# EAGLE design Steering_board (EAGLE 9.3.0)
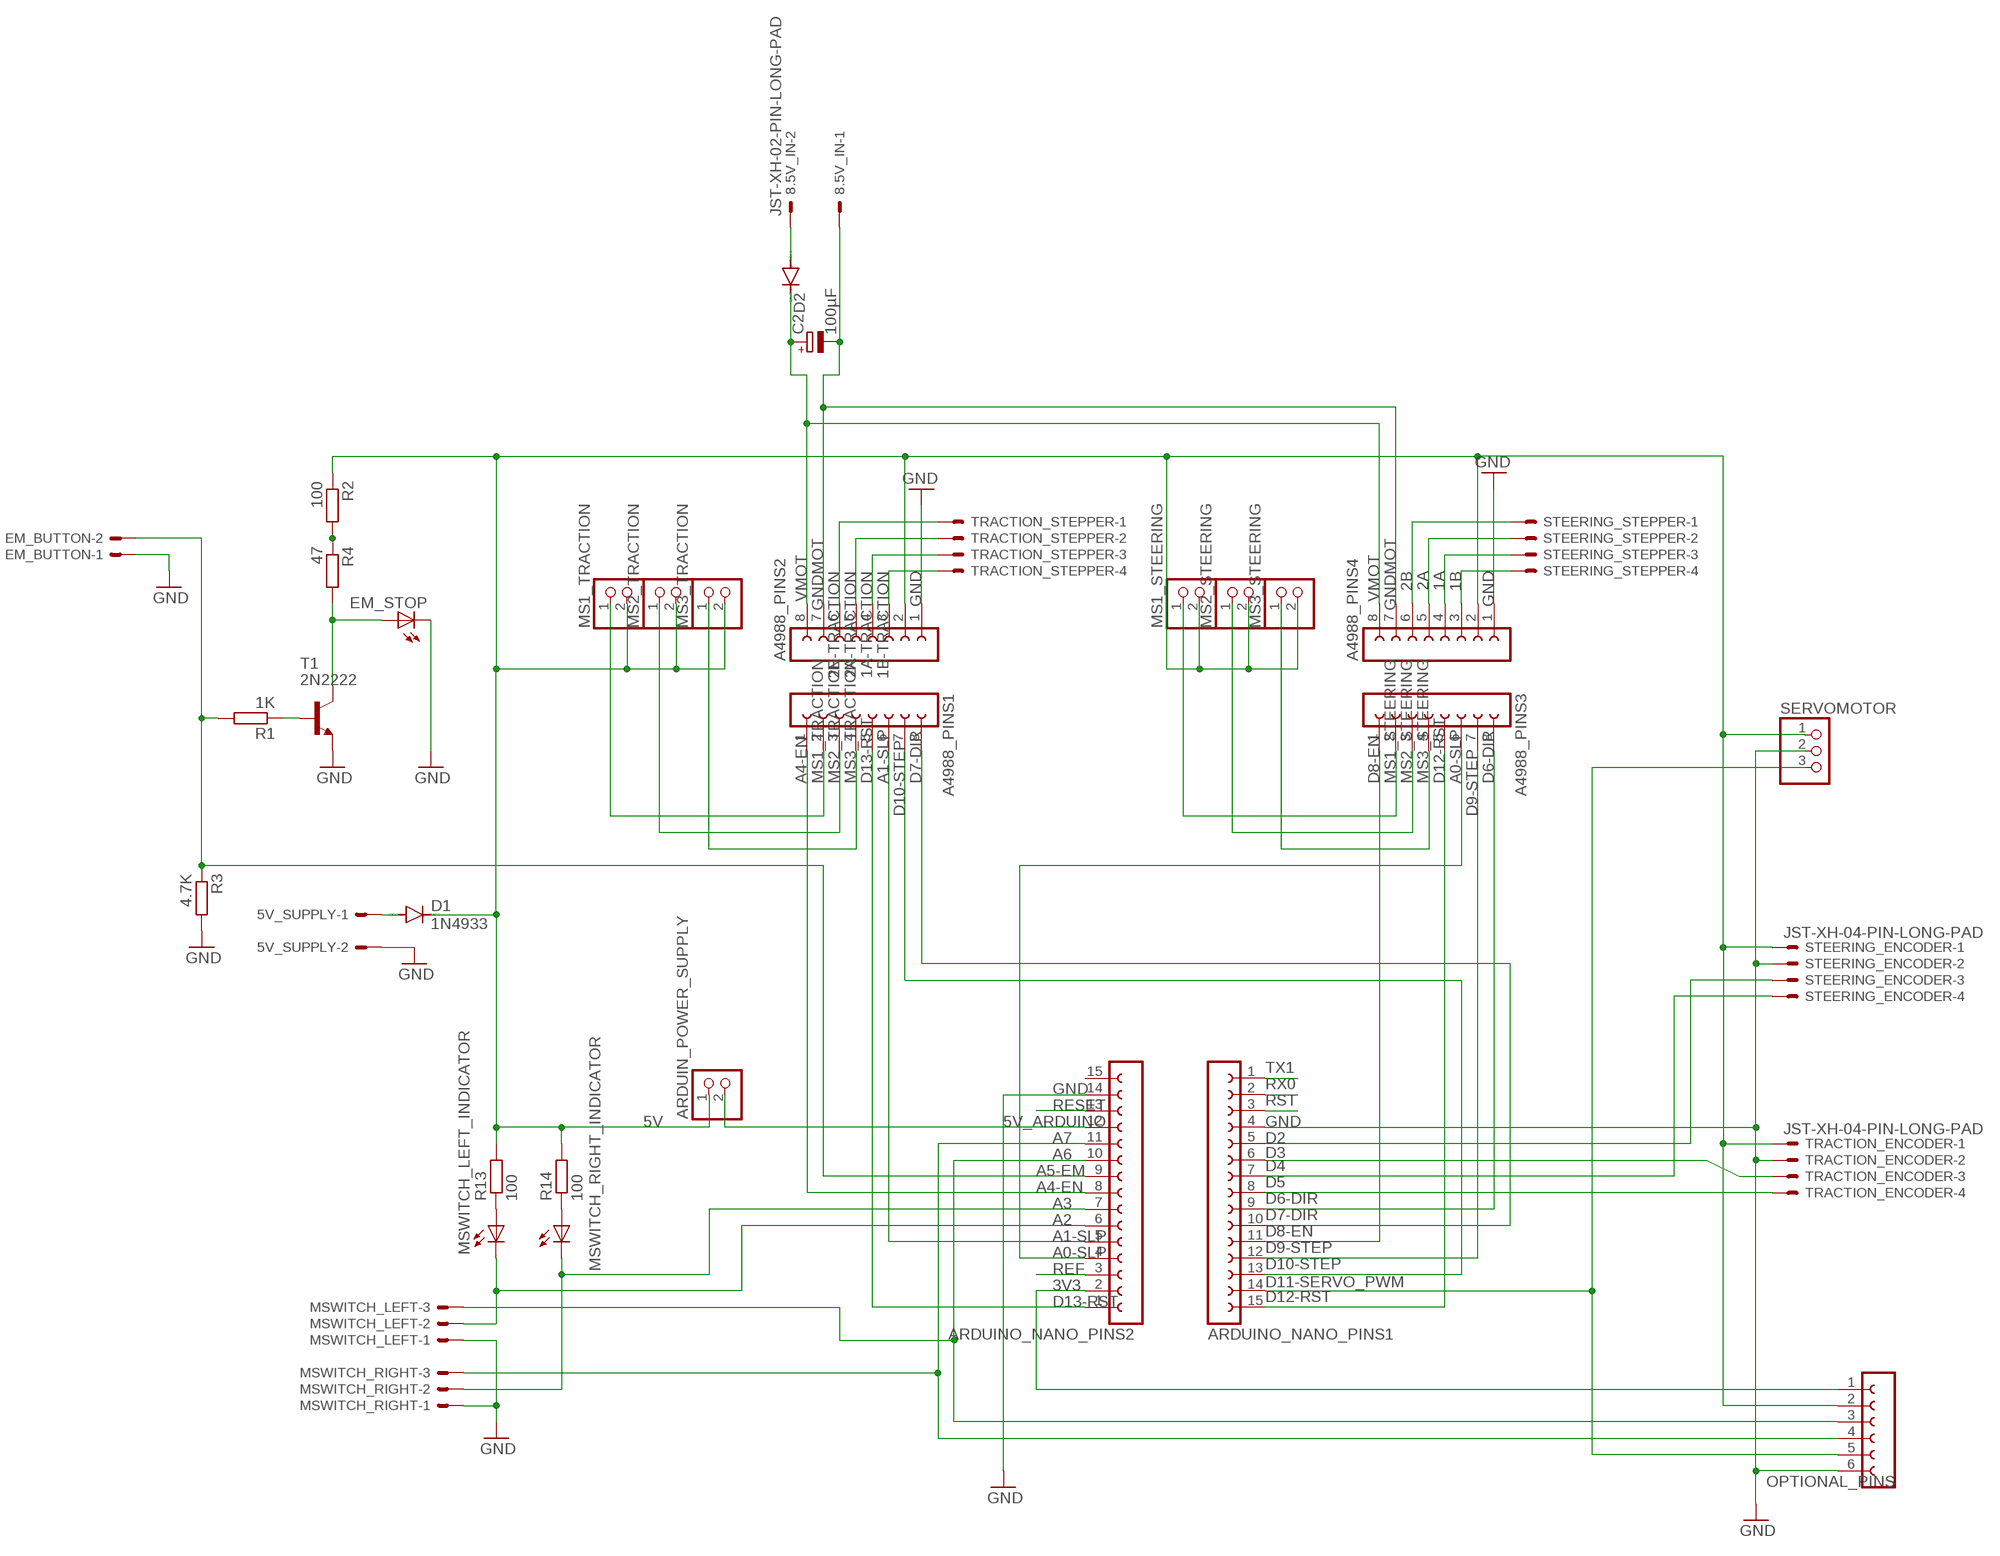
[diagram p0: schematic, sheet 1]

## Parts
5V_SUPPLY  JST-XH-02-PIN-LONG-PAD  [JST-XH-02-PACKAGE-LONG-PAD]
8.5V_IN  JST-XH-02-PIN-LONG-PAD  [JST-XH-02-PACKAGE-LONG-PAD]
A4988_PINS1  FE08-1  [FE08]
A4988_PINS2  FE08-1  [FE08]
A4988_PINS3  FE08-1  [FE08]
A4988_PINS4  FE08-1  [FE08]
ARDUIN_POWER_SUPPLY  PINHD-1X2  [1X02]
ARDUINO_NANO_PINS1  FE15-1  [FE15]
ARDUINO_NANO_PINS2  FE15-1  [FE15]
C2  100µF  CPOL-EUSANYO_E  [SANYO-OSCON_E]
D1  1N4933  [DO41-10]
D2  DIODE-DO15-12  [DO15-12]
EM_BUTTON  JST-XH-02-PIN-LONG-PAD  [JST-XH-02-PACKAGE-LONG-PAD]
EM_STOP  LED5MM  [LED5MM]
MS1_STEERING  PINHD-1X2  [1X02]
MS1_TRACTION  PINHD-1X2  [1X02]
MS2_STEERING  PINHD-1X2  [1X02]
MS2_TRACTION  PINHD-1X2  [1X02]
MS3_STEERING  PINHD-1X2  [1X02]
MS3_TRACTION  PINHD-1X2  [1X02]
MSWITCH_LEFT  JST-XH-03-PIN-LONG-PAD  [JST-XH-03-PACKAGE-LONG-PAD]
MSWITCH_LEFT_INDICATOR  LED5MM  [LED5MM]
MSWITCH_RIGHT  JST-XH-03-PIN-LONG-PAD  [JST-XH-03-PACKAGE-LONG-PAD]
MSWITCH_RIGHT_INDICATOR  LED5MM  [LED5MM]
OPTIONAL_PINS  FE06-1  [FE06]
R1  1K  R-EU_0207/7  [0207/7]
R2  100  R-EU_0207/7  [0207/7]
R3  4.7K  R-EU_0207/7  [0207/7]
R4  47  R-EU_0207/7  [0207/7]
R13  100  R-EU_0207/7  [0207/7]
R14  100  R-EU_0207/7  [0207/7]
SERVOMOTOR  PINHD-1X3  [1X03]
STEERING_ENCODER  JST-XH-04-PIN-LONG-PAD  [JST-XH-04-PACKAGE-LONG-PAD]
STEERING_STEPPER  JST-XH-04-PIN-LONG-PAD  [JST-XH-04-PACKAGE-LONG-PAD]
T1  2N2222  [TO92-EBC-OVAL]
TRACTION_ENCODER  JST-XH-04-PIN-LONG-PAD  [JST-XH-04-PACKAGE-LONG-PAD]
TRACTION_STEPPER  JST-XH-04-PIN-LONG-PAD  [JST-XH-04-PACKAGE-LONG-PAD]

## Nets
1A [Large]: A4988_PINS4.4 STEERING_STEPPER.3
1A-TRACTION [Large]: A4988_PINS2.4 TRACTION_STEPPER.3
1B [Large]: A4988_PINS4.3 STEERING_STEPPER.4
1B-TRACTION [Large]: A4988_PINS2.3 TRACTION_STEPPER.4
2A [Large]: A4988_PINS4.5 STEERING_STEPPER.2
2A-TRACTION [Large]: A4988_PINS2.5 TRACTION_STEPPER.2
2B [Large]: A4988_PINS4.6 STEERING_STEPPER.1
2B-TRACTION [Large]: A4988_PINS2.6 TRACTION_STEPPER.1
3V3: ARDUINO_NANO_PINS2.2 OPTIONAL_PINS.1
5V: A4988_PINS2.2 A4988_PINS4.2 ARDUIN_POWER_SUPPLY.1 D1.C MS1_STEERING.2 MS1_TRACTION.2 MS2_STEERING.2 MS2_TRACTION.2 MS3_STEERING.2 MS3_TRACTION.2 OPTIONAL_PINS.2 R2.1 R13.2 R14.2 SERVOMOTOR.1 STEERING_ENCODER.1 TRACTION_ENCODER.1
5V_ARDUINO: ARDUIN_POWER_SUPPLY.2 ARDUINO_NANO_PINS2.12
A0-SLP: A4988_PINS3.6 ARDUINO_NANO_PINS2.4
A1-SLP: A4988_PINS1.6 ARDUINO_NANO_PINS2.5
A2: ARDUINO_NANO_PINS2.6 MSWITCH_LEFT.2 MSWITCH_LEFT_INDICATOR.K(C)
A3: ARDUINO_NANO_PINS2.7 MSWITCH_RIGHT.2 MSWITCH_RIGHT_INDICATOR.K(C)
A4-EN: A4988_PINS1.1 ARDUINO_NANO_PINS2.8
A5-EM: ARDUINO_NANO_PINS2.9 EM_BUTTON.2 R1.2 R3.1
A6: ARDUINO_NANO_PINS2.10 MSWITCH_LEFT.3 OPTIONAL_PINS.3
A7: ARDUINO_NANO_PINS2.11 MSWITCH_RIGHT.3 OPTIONAL_PINS.4
D2: ARDUINO_NANO_PINS1.5 STEERING_ENCODER.3
D3: ARDUINO_NANO_PINS1.6 TRACTION_ENCODER.3
D4: ARDUINO_NANO_PINS1.7 STEERING_ENCODER.4
D5: ARDUINO_NANO_PINS1.8 TRACTION_ENCODER.4
D6-DIR: A4988_PINS3.8 ARDUINO_NANO_PINS1.9
D7-DIR: A4988_PINS1.8 ARDUINO_NANO_PINS1.10
D8-EN: A4988_PINS3.1 ARDUINO_NANO_PINS1.11
D9-STEP: A4988_PINS3.7 ARDUINO_NANO_PINS1.12
D10-STEP: A4988_PINS1.7 ARDUINO_NANO_PINS1.13
D11-SERVO_PWM: ARDUINO_NANO_PINS1.14 OPTIONAL_PINS.5 SERVOMOTOR.3
D12-RST: A4988_PINS3.5 ARDUINO_NANO_PINS1.15
D13-RST: A4988_PINS1.5 ARDUINO_NANO_PINS2.1
GND: 5V_SUPPLY.2 A4988_PINS2.1 A4988_PINS4.1 ARDUINO_NANO_PINS1.4 ARDUINO_NANO_PINS2.14 EM_BUTTON.1 EM_STOP.K(C) MSWITCH_LEFT.1 MSWITCH_RIGHT.1 OPTIONAL_PINS.6 R3.2 SERVOMOTOR.2 STEERING_ENCODER.2 T1.E TRACTION_ENCODER.2
GNDMOT [Large]: 8.5V_IN.1 A4988_PINS2.7 A4988_PINS4.7 C2.-
MS1_STEERING: A4988_PINS3.2 MS1_STEERING.1
MS1_TRACTION: A4988_PINS1.2 MS1_TRACTION.1
MS2_STEERING: A4988_PINS3.3 MS2_STEERING.1
MS2_TRACTION: A4988_PINS1.3 MS2_TRACTION.1
MS3_STEERING: A4988_PINS3.4 MS3_STEERING.1
MS3_TRACTION: A4988_PINS1.4 MS3_TRACTION.1
N$1 [Large]: 8.5V_IN.2 D2.A
N$2: 5V_SUPPLY.1 D1.A
N$4: R2.2 R4.1
N$6: EM_STOP.A R4.2 T1.C
N$7: R1.1 T1.B
N$29: MSWITCH_LEFT_INDICATOR.A R13.1
N$30: MSWITCH_RIGHT_INDICATOR.A R14.1
REF: ARDUINO_NANO_PINS2.3
RESET: ARDUINO_NANO_PINS2.13
RST: ARDUINO_NANO_PINS1.3
RX0: ARDUINO_NANO_PINS1.2
TX1: ARDUINO_NANO_PINS1.1
VMOT [Large]: A4988_PINS2.8 A4988_PINS4.8 C2.+ D2.C
Unconnected: ARDUINO_NANO_PINS2.15

## Library data of the parts
5V_SUPPLY 8.5V_IN EM_BUTTON = Rembrandt Electronics - JST XH Connectors v1-0:JST-XH-02-PIN: JST XH Connector 2 Pin Wire to board connector. Pitch: 2,54 mm, (0.100") Number of pins: 2 Created by Rembrandt Electronics www.rembrandtelectronics.com
A4988_PINS1-A4988_PINS4 = con-lsta:FE08-1: FEMALE HEADER; OC_FARNELL: unknown; OC_NEWARK: unknown
ARDUIN_POWER_SUPPLY MS1_STEERING MS1_TRACTION MS2_STEERING MS2_TRACTION MS3_STEERING MS3_TRACTION = pinhead:PINHD-1X2: PIN HEADER
ARDUINO_NANO_PINS1 ARDUINO_NANO_PINS2 = con-lsta:FE15-1: FEMALE HEADER; OC_FARNELL: unknown; OC_NEWARK: unknown
C2 = rcl:CPOL-EU: POLARIZED CAPACITOR, European symbol; SPICEPREFIX: C
D1 = diode:1N4933: DIODE fast recovery rectifier, 1A
D2 = diode:DIODE-: DIODE
EM_STOP MSWITCH_LEFT_INDICATOR MSWITCH_RIGHT_INDICATOR = adafruit:LED: LED OSRAM: - CHIPLED LG R971, LG N971, LY N971, LG Q971, LY Q971, LO R971, LY R971 LH N974, LH R974 LS Q976, LO Q976, LY Q976 LO Q996 - Hyper CHIPLED LW Q18S LB Q993, LB Q99A, LB R99A - SideLED LS A670, LO A670, LY A670, LG A670, LP A670 LB A673, LV A673, LT A673, LW A673 LH A674 LY A675 LS A676, LA A676, LO A676, LY A676, LW A676 LS A679, LY A679, LG A679 - Hyper Micro SIDELED® LS Y876, LA Y876, LO Y876, LY Y876 LT Y87S - SmartLED LW L88C, LW L88S LB L89C, LB L89S, LG L890 LS L89K, LO L89K, LY L89K LS L896, LA L896, LO L896, LY L896 - TOPLED LS T670, LO T670, LY T670, LG T670, LP T670 LSG T670, LSP T670, LSY T670, LOP T670, LYG T670 LG T671, LOG T671, LSG T671 LB T673, LV T673, LT T673, LW T673 LH T674 LS T676, LA T676, LO T676, LY T676, LB T676, LH T676, LSB T676, LW T676 LB T67C, LV T67C, LT T67C, LS T67K, LO T67K, LY T67K, LW E67C LS E67B, LA E67B, LO E67B, LY E67B, LB E67C, LV E67C, LT E67C LW T67C LS T679, LY T679, LG T679 LS T770, LO T770, LY T770, LG T770, LP T770 LB T773, LV T773, LT T773, LW T773 LH T774 LS E675, LA E675, LY E675, LS T675 LS T776, LA T776, LO T776, LY T776, LB T776 LHGB T686 LT T68C, LB T68C - Hyper Mini TOPLED® LB M676 - Mini TOPLED Santana® LG M470 LS M47K, LO M47K, LY M47K Source: http://www.osram.convergy.de/
MSWITCH_LEFT MSWITCH_RIGHT = Rembrandt Electronics - JST XH Connectors v1-0:JST-XH-03-PIN: JST XH Connector 2 Pin Wire to board connector. Pitch: 2,54 mm, (0.100") Number of pins: 3 Created by Rembrandt Electronics www.rembrandtelectronics.com
OPTIONAL_PINS = con-lsta:FE06-1: FEMALE HEADER; OC_FARNELL: unknown; OC_NEWARK: unknown
R1-R4 R13 R14 = rcl:R-EU_: RESISTOR, European symbol; SPICEPREFIX: R
SERVOMOTOR = adafruit:PINHD-1X3: PIN HEADER
STEERING_ENCODER STEERING_STEPPER TRACTION_ENCODER TRACTION_STEPPER = Rembrandt Electronics - JST XH Connectors v1-0:JST-XH-04-PIN: JST XH Connector 2 Pin Wire to board connector. Pitch: 2,54 mm, (0.100") Number of pins: 4 Created by Rembrandt Electronics www.rembrandtelectronics.com
T1 = adafruit:2N2222: NPN TRANSISTOR Big oval pads

## Net classes
1 Large: width 1 mm, drill 0.65 mm

## Board
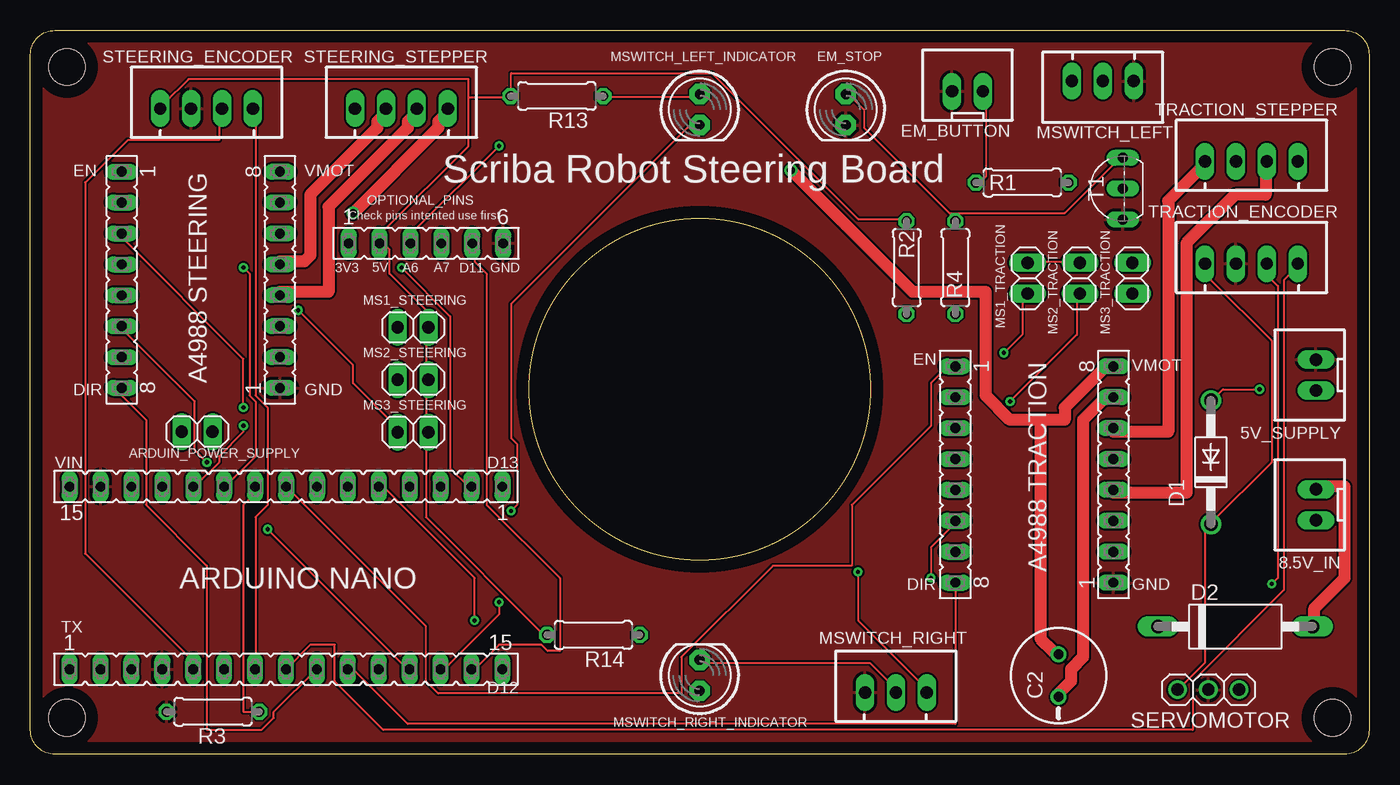
[diagram p1: board, top side]
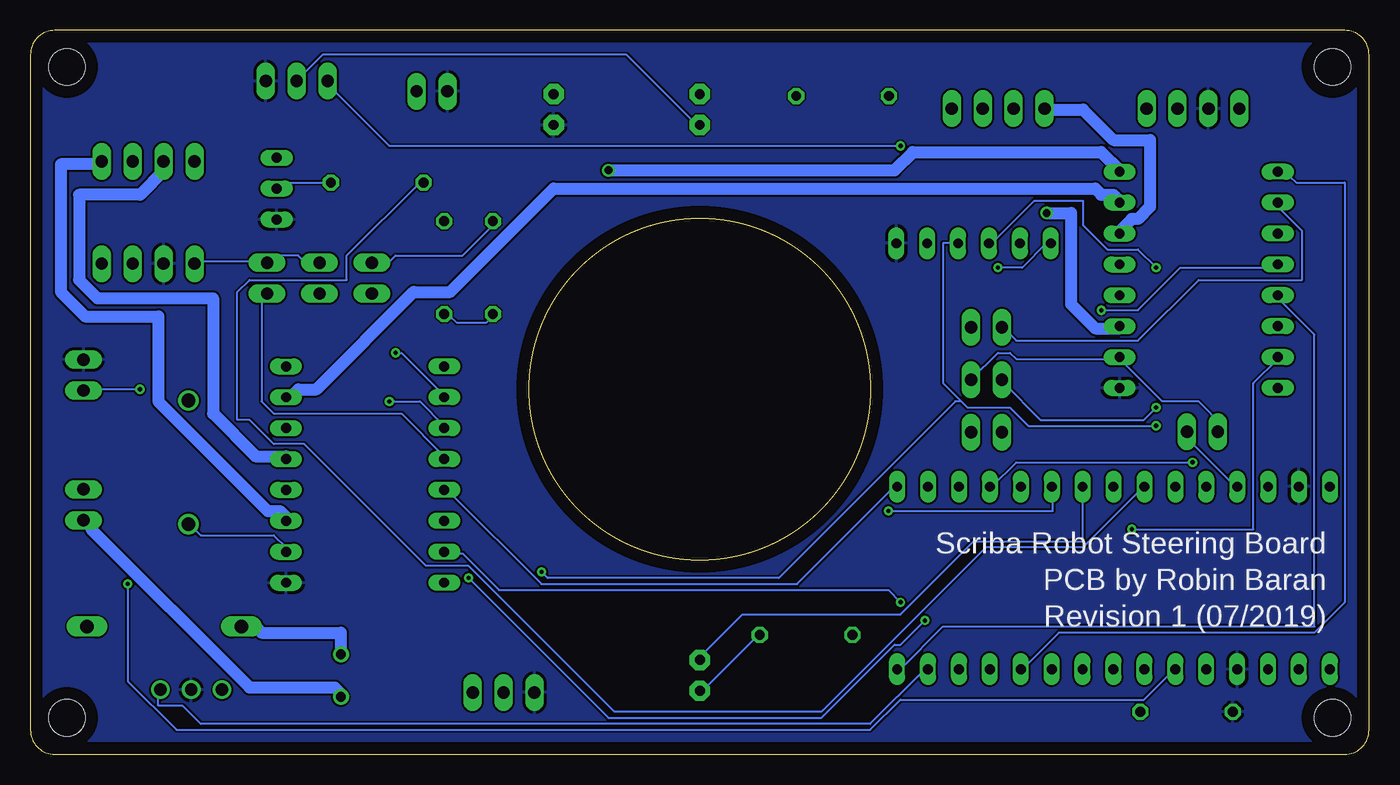
[diagram p2: board, bottom side, seen from below]

Size 110 x 59.5 mm. Coordinates in mm from the lower left corner, seen from the top.
Outline: 2,59.5 108,59.5 arc-90 110,57.5 110,2 arc-90 108,0 2,0 arc-90 0,2 0,57.5 arc-90 2,59.5
Outline: circle at 55,30 radius 14.04
Copper layers (1*16): Top 0.035mm / dielectric 1.5mm / Bottom 0.035mm
Design rules "default": minimum track width 6mil, minimum drill 0.35mm, track to track 6mil, track to pad 6mil, pad to pad 6mil, via to via 6mil, smd to smd 6mil, copper to edge 40mil, drill to drill 6mil, minimum pad ring 10mil, minimum via ring 8mil, stop-mask expansion 4mil, vias tented up to drill 0mil, thermal gap 10mil
Holes 3 mm at 107,56.5 107,3 3,3 3,56.5
tRestrict: area 45,20 to 65,40
bRestrict: area 45,20 to 65,40

### Footprints (pad centres in the part's own frame; a part is rotated, then mirrored left to right if it is on the bottom)
JST-XH-02-PACKAGE-LONG-PAD = drill 1.016 long: 1 -1.27,0; 2 1.27,0
FE08 = drill 0.813 long: 1 -8.89,0; 2 -6.35,0; 3 -3.81,0; 4 -1.27,0; 5 1.27,0; 6 3.81,0; 7 6.35,0; 8 8.89,0
1X02 = drill 1.016 long: 1 -1.27,0; 2 1.27,0
FE15 = drill 0.813 long: 1 -17.78,0; 2 -15.24,0; 3 -12.7,0; 4 -10.16,0; 5 -7.62,0; 6 -5.08,0; 7 -2.54,0; 8 0,0; 9 2.54,0; 10 5.08,0; 11 7.62,0; 12 10.16,0; 13 12.7,0; 14 15.24,0; 15 17.78,0
SANYO-OSCON_E = drill 0.8 pad 1.27: + 1.75,0; - -1.75,0
DO41-10 = drill 1.118: A 5.08,0; C -5.08,0
DO15-12 = drill 1.118 long: A 6.35,0; C -6.35,0
LED5MM = drill 0.813 pad 1.676 octagon: A -1.27,0; K 1.27,0
JST-XH-03-PACKAGE-LONG-PAD = drill 1.016 long: 1 -2.54,0; 2 0,0; 3 2.54,0
FE06 = drill 0.813 long: 1 -6.35,0; 2 -3.81,0; 3 -1.27,0; 4 1.27,0; 5 3.81,0; 6 6.35,0
0207/7 = drill 0.813 octagon: 1 -3.81,0; 2 3.81,0
1X03 = drill 1.016: 1 -2.54,0; 2 0,0; 3 2.54,0
JST-XH-04-PACKAGE-LONG-PAD = drill 1.016 long: 1 -3.81,0; 2 -1.27,0; 3 1.27,0; 4 3.81,0
TO92-EBC-OVAL = drill 0.813 long: B 0,-1.27; C 2.54,-1.27; E -2.54,-1.27

### Placement (x,y rotation side)
5V_SUPPLY  105.64,31.17 90 top
8.5V_IN  105.64,20.51 90 top
A4988_PINS1  76,23 270 top
A4988_PINS2  89,23 90 top
A4988_PINS3  7.5,39 270 top
A4988_PINS4  20.5,39 90 top
ARDUIN_POWER_SUPPLY  13.7,26.52 0 top
ARDUINO_NANO_PINS1  21,7 0 top
ARDUINO_NANO_PINS2  21,22 180 top
C2  84.48,6.47 90 top
D1  97,24 90 top
D2  99,10.5 0 top
EM_BUTTON  77,54.5 0 top
EM_STOP  67,53 270 top
MS1_STEERING  31.44,35.1 0 top
MS1_TRACTION  81.93,39.14 90 top
MS2_STEERING  31.44,30.79 0 top
MS2_TRACTION  86.24,39.14 90 top
MS3_STEERING  31.44,26.48 0 top
MS3_TRACTION  90.55,39.14 90 top
MSWITCH_LEFT  88.12,55.34 180 top
MSWITCH_LEFT_INDICATOR  55,53 270 top
MSWITCH_RIGHT  71.12,5.08 0 top
MSWITCH_RIGHT_INDICATOR  54.99,6.49 90 top
OPTIONAL_PINS  32.5,42 0 top
R1  81.5,47 180 top
R2  72,40 270 top
R3  15,3.5 180 top
R4  76,40 90 top
R13  43.26,54.11 180 top
R14  46.26,9.81 180 top
SERVOMOTOR  96.79,5.31 0 top
STEERING_ENCODER  14.47,53.07 0 top
STEERING_STEPPER  30.48,53.07 0 top
T1  88.5,46.5 90 top
TRACTION_ENCODER  100.33,40.33 0 top
TRACTION_STEPPER  100.33,48.72 0 top

### Tracks (layer width: path | path; a pad name or v marks a point on that pad's centre or on a via)
1A
  Top 1: A4988_PINS4.4 20.5,38 24.5,38 24.5,45 31,51.5 31,52 31.5,52.5 31.5,53 STEERING_STEPPER.3
1A-TRACTION
  Top 1: A4988_PINS2.4 89,21.5 95,21.5 95,42 99,46 101.5,46 101.5,48.5 TRACTION_STEPPER.3
1B  (via drill 0.65)
  Top 1: v26.5,44.5 33.5,51.5 33.5,52 34,52.5 34,53 STEERING_STEPPER.4
  Bottom 1: v26.5,44.5 24.5,44.5 24.5,37 22.5,35 20.5,35 A4988_PINS4.3
1B-TRACTION
  Bottom 1: A4988_PINS2.3 89,19.5 89.5,20 90.5,20 99.5,29 99.5,36 105.5,36 107.5,38 107.5,48.5 104.5,48.5 TRACTION_STEPPER.4
2A
  Top 1: A4988_PINS4.5 20.5,40.5 22.5,40.5 23,41 23,46 28.5,51.5 28.5,52 29,52.5 29,53 STEERING_STEPPER.2
2A-TRACTION
  Bottom 1: A4988_PINS2.5 89,24.5 91.5,24.5 95,28 95,37.5 104.5,37.5 106,39 106,46 101,46 99,48 99,48.5 TRACTION_STEPPER.2
2B
  Bottom 1: A4988_PINS4.6 20.5,43 19.5,44 19,44 18,45 18,50.5 21,50.5 23.5,53 26.5,53 STEERING_STEPPER.1
2B-TRACTION
  Top 1: A4988_PINS2.6 89,26.5 93.5,26.5 93.5,45.5 96,48 96.5,48 96.5,48.5 TRACTION_STEPPER.1
3V3  (via drill 0.35)
  Top 0.152: v30.5,40 34.5,36 34.5,23.5 36,22 ARDUINO_NANO_PINS2.2
  Bottom 0.152: v30.5,40 28.5,40 26.5,42 OPTIONAL_PINS.1
5V
  Top 0.152: 97,19 96.5,18.5 96.5,7.5 94.5,5.5 SERVOMOTOR.1 | MS2_TRACTION.2 86,40.5 82,40.5 MS1_TRACTION.2 | 97,19 102,24 102,34 97,39 97,40 TRACTION_ENCODER.1 | 97,19 D1.C | R14.2 42,10 32.5,19.5 32.5,26 MS3_STEERING.2 32.5,26.5 32.5,30.5 MS2_STEERING.2 32.5,31 32.5,35 MS1_STEERING.2 32.5,35.5 32.5,36.5 29.5,39.5 29.5,41.5 29,42 | 36,54 39,54 R13.2 39.5,54.5 39.5,56 56,56 68,44 72,44 R2.1 | 36,54 36,50 29,43 29,42 | 29,42 OPTIONAL_PINS.2 | 36,54 36,55.5 13,55.5 11,53.5 STEERING_ENCODER.1
  Bottom 0.152: A4988_PINS2.2 89,17 90,18 96,18 96.5,18.5 97,18.5 D1.C | R2.1 72,43.5 74.5,41 80,41 80.5,40.5 81.5,40.5 MS1_TRACTION.2 | MS2_TRACTION.2 86.5,40.5 87.5,40.5 88,41 90,41 90.5,40.5 MS3_TRACTION.2 91,40.5 96.5,40.5 TRACTION_ENCODER.1 | 20.5,32.5 17,29 14,29 12,27 ARDUIN_POWER_SUPPLY.1 | 20.5,32.5 29,32.5 29.5,33 30.5,33 MS2_STEERING.2 | 20.5,32.5 A4988_PINS4.2
5V_ARDUINO
  Bottom 0.152: ARDUINO_NANO_PINS2.12 11,22 14.5,25.5 14.5,26.5 ARDUIN_POWER_SUPPLY.2
A0-SLP  (via drill 0.35)
  Top 0.152: v14.5,24 13.5,25 13.5,29 7.5,35 A4988_PINS3.6
  Bottom 0.152: v14.5,24 29,24 31,22 ARDUINO_NANO_PINS2.4
A1-SLP  (via drill 0.35)
  Top 0.152: v36.5,11 36.5,14.5 29,22 ARDUINO_NANO_PINS2.5 | v74,14.5 74,17 76,19 A4988_PINS1.6
  Bottom 0.152: v36.5,11 38.5,9 39,9 45,3 62.5,3 v74,14.5
A2  (via drill 0.35)
  Top 0.152: v39.5,20 40,20.5 40,25.5 39.5,26 39.5,37 54,51.5 55,51.5 MSWITCH_LEFT_INDICATOR.K
  Bottom 0.152: v39.5,20 26,20 26,22 ARDUINO_NANO_PINS2.6 | MSWITCH_LEFT.2 88,55.5 86,57.5 61,57.5 55.5,52 55,52 MSWITCH_LEFT_INDICATOR.K
A3
  Top 0.152: MSWITCH_RIGHT.2 71,5.5 69,7.5 55,7.5 MSWITCH_RIGHT_INDICATOR.K
  Bottom 0.152: ARDUINO_NANO_PINS2.7 23.5,22 23.5,17.5 32.5,17.5 38.5,11.5 51.5,11.5 55,8 MSWITCH_RIGHT_INDICATOR.K
A4-EN
  Top 0.152: ARDUINO_NANO_PINS2.8 32.5,10.5 32.5,6 33.5,5 53.5,5 53.5,8 61,15.5 67.5,15.5 67.5,20.5 74,27 74,30.5 75,31.5 76,31.5 A4988_PINS1.1
A5-EM
  Top 0.152: R1.2 78,47 78.5,47.5 78.5,54.5 EM_BUTTON.2 | R3.1 17.5,3.5 17.5,20.5 18,21 18,22 ARDUINO_NANO_PINS2.9
  Bottom 0.152: R1.2 78,47 84,41 84,39 92,39 93,38 93,27.5 92,27.5 90,25.5 87.5,25.5 77.5,15.5 74,15.5 62,3.5 45,3.5 31.5,17 23.5,17 18.5,22 ARDUINO_NANO_PINS2.9
A6  (via drill 0.35)
  Top 0.152: v17.5,40 18,39.5 18,29.5 18.5,29 18.5,24.5 16,22 ARDUINO_NANO_PINS2.10 | v38.5,50 31.5,43 31.5,42 OPTIONAL_PINS.3
  Bottom 0.152: v17.5,40 19,41.5 21.5,41.5 23.5,43.5 23.5,45.5 27.5,45.5 31,42 OPTIONAL_PINS.3 | v38.5,50 80.5,50 85.5,55 MSWITCH_LEFT.3
A7  (via drill 0.35)
  Top 0.152: v17.5,27 17.5,26.5 15.5,24.5 15.5,24 13.5,22 ARDUINO_NANO_PINS2.11 | v68,15 68,11 73.5,5.5 MSWITCH_RIGHT.3
  Bottom 0.152: v17.5,27 28,27 29.5,28.5 33,28.5 33.5,29 | 33.5,29 35,30.5 35,42 OPTIONAL_PINS.4 | v68,15 67.5,14.5 48.5,14.5 34,29 33.5,29
D2
  Top 0.152: ARDUINO_NANO_PINS1.5 13,7 13,8 4.5,16.5 4.5,47 8,50.5 15.5,50.5 15.5,53 STEERING_ENCODER.3
D3  (via drill 0.35)
  Top 0.152: v102,14 102.5,14.5 102.5,38.5 102,39 102,40 TRACTION_ENCODER.3
  Bottom 0.152: v102,14 102,6 98,2 41,2 38.5,4.5 18.5,4.5 16,7 ARDUINO_NANO_PINS1.6
D4
  Top 0.152: ARDUINO_NANO_PINS1.7 18.5,7 18.5,19.5 19.5,20.5 19.5,28.5 18.5,29.5 18.5,53 STEERING_ENCODER.4
D5
  Top 0.152: ARDUINO_NANO_PINS1.8 23,9 25,9 25,6 29,2 95.5,2 95.5,6 103,13.5 103,39 104,40 TRACTION_ENCODER.4
D6-DIR
  Top 0.152: A4988_PINS3.8 7.5,29.5 9.5,27.5 9.5,20.5 14.5,15.5 14.5,2 19,2 20,3 20,3.5 23.5,7 ARDUINO_NANO_PINS1.9
D7-DIR
  Top 0.152: A4988_PINS1.8 76,2.5 31,2.5 26.5,7 ARDUINO_NANO_PINS1.10
D8-EN
  Bottom 0.152: ARDUINO_NANO_PINS1.11 28.5,7 25.5,10 4.5,10 2,12.5 2,47 6,47 6.5,47.5 7.5,47.5 A4988_PINS3.1
D9-STEP  (via drill 0.35)
  Top 0.152: v19.5,18.5 31,7 ARDUINO_NANO_PINS1.12
  Bottom 0.152: v19.5,18.5 9.5,18.5 9.5,30.5 7.5,32.5 A4988_PINS3.7
D10-STEP  (via drill 0.35)
  Top 0.152: v38.5,12.5 38.5,11.5 34,7 ARDUINO_NANO_PINS1.13
  Bottom 0.152: v38.5,12.5 39.5,13.5 71.5,13.5 74.5,16.5 76,16.5 A4988_PINS1.7
D11-SERVO_PWM
  Top 0.152: ARDUINO_NANO_PINS1.14 36.5,7 38.5,9 42,9 42.5,8.5 43.5,8.5 43.5,14.5 37.5,20.5 37.5,39.5 36.5,40.5 36.5,42 OPTIONAL_PINS.5
  Bottom 0.152: SERVOMOTOR.3 99.5,5 99.5,4 97.5,4 96,2.5 41,2.5 36.5,7 ARDUINO_NANO_PINS1.14
D12-RST
  Bottom 0.152: A4988_PINS3.5 7.5,37.5 4.5,34.5 4.5,10.5 35,10.5 38.5,7 ARDUINO_NANO_PINS1.15
D13-RST
  Bottom 0.152: ARDUINO_NANO_PINS2.1 39,22 47,14 68,14 75.5,21.5 76,21.5 A4988_PINS1.5
GND
  pour Top: -0.5,-0.5 -0.5,60 110.5,60 110.5,-0.5
  pour Bottom: -0.5,-0.5 -0.5,60 110.5,60 110.5,-0.5
GNDMOT
  Top 1: C2.- 84.5,5 85.5,6 85.5,7 86.5,8 86.5,27.5 88.5,29.5 89,29.5 A4988_PINS2.7
  Bottom 1: C2.- 84.5,5 85,5.5 92,5.5 105,18.5 105,19 105.5,19 8.5V_IN.1 | A4988_PINS4.7 20.5,45.5 21,46 22,46 22.5,46.5 67,46.5 75.5,38 78.5,38 86.5,30 88,30 88.5,29.5 89,29.5 A4988_PINS2.7
MS1_STEERING
  Bottom 0.152: A4988_PINS3.2 7.5,45 5.5,43 5.5,39 14,39 19,34 29,34 30,35 MS1_STEERING.1
MS1_TRACTION  (via drill 0.35)
  Top 0.152: v80,33 81.5,34.5 81.5,37.5 MS1_TRACTION.1
  Bottom 0.152: v80,33 79.5,33 76,29.5 A4988_PINS1.2
MS2_STEERING  (via drill 0.35)
  Top 0.152: v17.5,28.5 17.5,32.5 7.5,42.5 A4988_PINS3.3
  Bottom 0.152: v17.5,28.5 18.5,27.5 27,27.5 30,30.5 MS2_STEERING.1
MS2_TRACTION  (via drill 0.35)
  Top 0.152: v80.5,29 86,34.5 86,37.5 MS2_TRACTION.1
  Bottom 0.152: v80.5,29 78,29 76,27 A4988_PINS1.3
MS3_STEERING  (via drill 0.35)
  Top 0.152: v22,36.5 26.5,32 26.5,30.5 30,27 30,26.5 MS3_STEERING.1
  Bottom 0.152: v22,36.5 19,36.5 15.5,40 7.5,40 A4988_PINS3.4
MS3_TRACTION
  Bottom 0.152: A4988_PINS1.4 76,24.5 79.5,28 90,28 91,29 91,37.5 MS3_TRACTION.1
N$1
  Top 1: 8.5V_IN.2 106,22 108,22 108,14.5 105.5,12 105.5,10.5 D2.A
N$2  (via drill 0.35)
  Top 0.152: v101,30 98,30 97,29 D1.A
  Bottom 0.152: v101,30 105.5,30 5V_SUPPLY.1
N$4
  Bottom 0.152: R2.2 72,36 72.5,35.5 75,35.5 75.5,36 76,36 R4.1
N$6
  Top 0.152: 75.5,44.5 68.5,51.5 68.5,53 67,54.5 EM_STOP.A | 75.5,44.5 76,44 R4.2 | 75.5,44.5 85,44.5 89.5,49 T1.C
N$7
  Bottom 0.152: R1.1 89,47 89.5,46.5 T1.B
N$29
  Top 0.152: R13.1 47.5,54 55,54 MSWITCH_LEFT_INDICATOR.A
N$30
  Bottom 0.152: R14.1 50.5,9.5 54.5,5.5 MSWITCH_RIGHT_INDICATOR.A
VMOT  (via drill 0.65)
  Top 1: v62.5,48 72.5,38 78.5,38 78.5,29.5 80.5,27.5 83,27.5 | 83,27.5 85,27.5 85,28.5 88.5,32 89,32 A4988_PINS2.8 | 83,27.5 83,9.5 84,8.5 C2.+
  Bottom 1: D2.C 91.5,10.5 91,10 84.5,10 84.5,8.5 C2.+ | v62.5,48 39,48 37.5,49.5 22,49.5 20.5,48 A4988_PINS4.8

### Text on the board
tNames: EN | VMOT | Scriba Robot Steering Board | Check pins intented use first | 3V3 | 5V | A6 | A7 | D11 | GND | EN | VMOT | DIR | A4988 STEERING | GND | VIN | D13 | A4988 TRACTION | ARDUINO NANO | DIR | GND | TX | D12
bNames: Scriba Robot Steering Board | PCB by Robin Baran | Revision 1 (07/2019)